# Altium schematic sheet Private_CPU_IO.SchDoc
size D
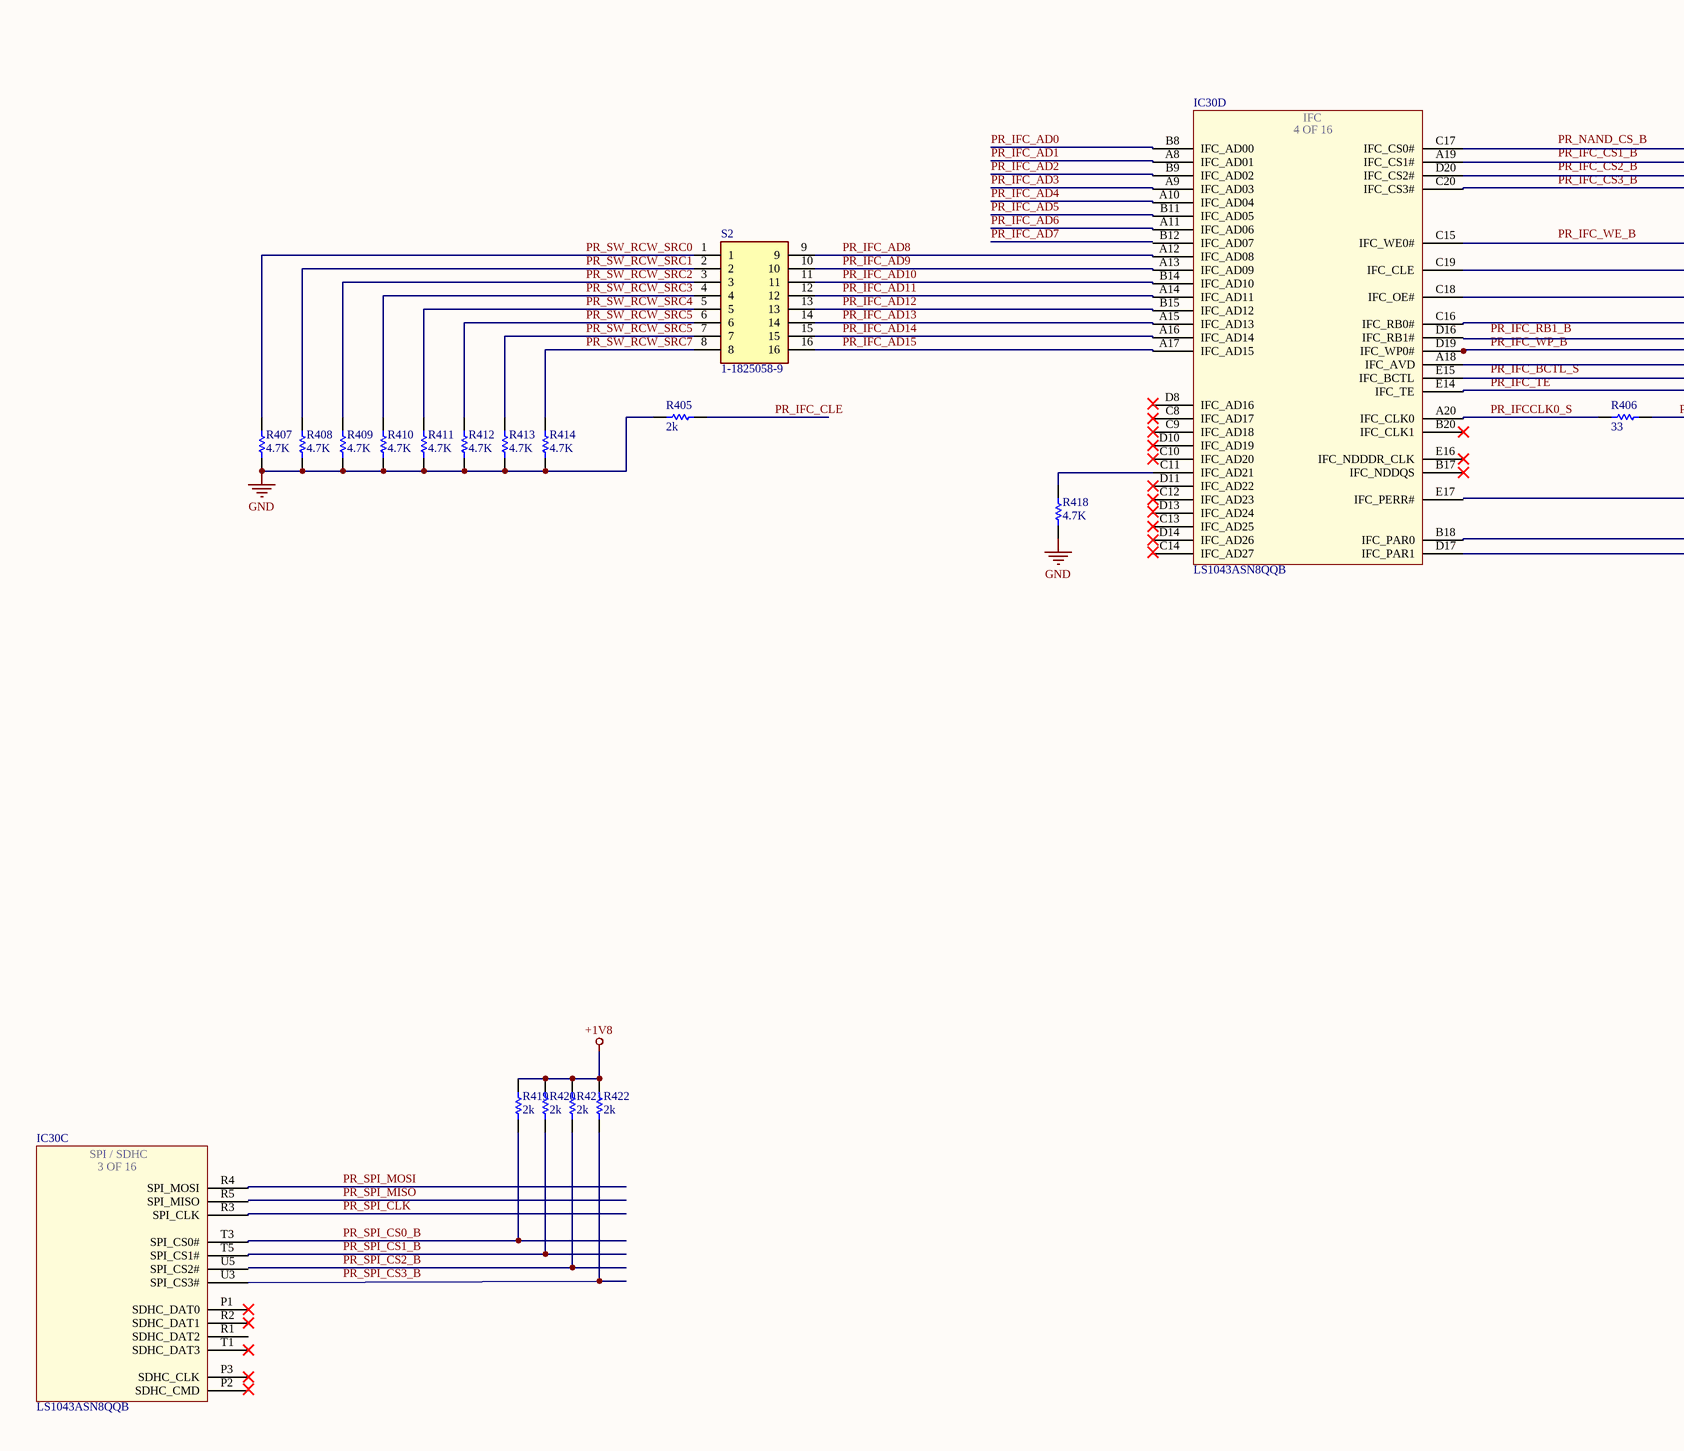
[diagram p0: Private_CPU_IO.SchDoc, left]
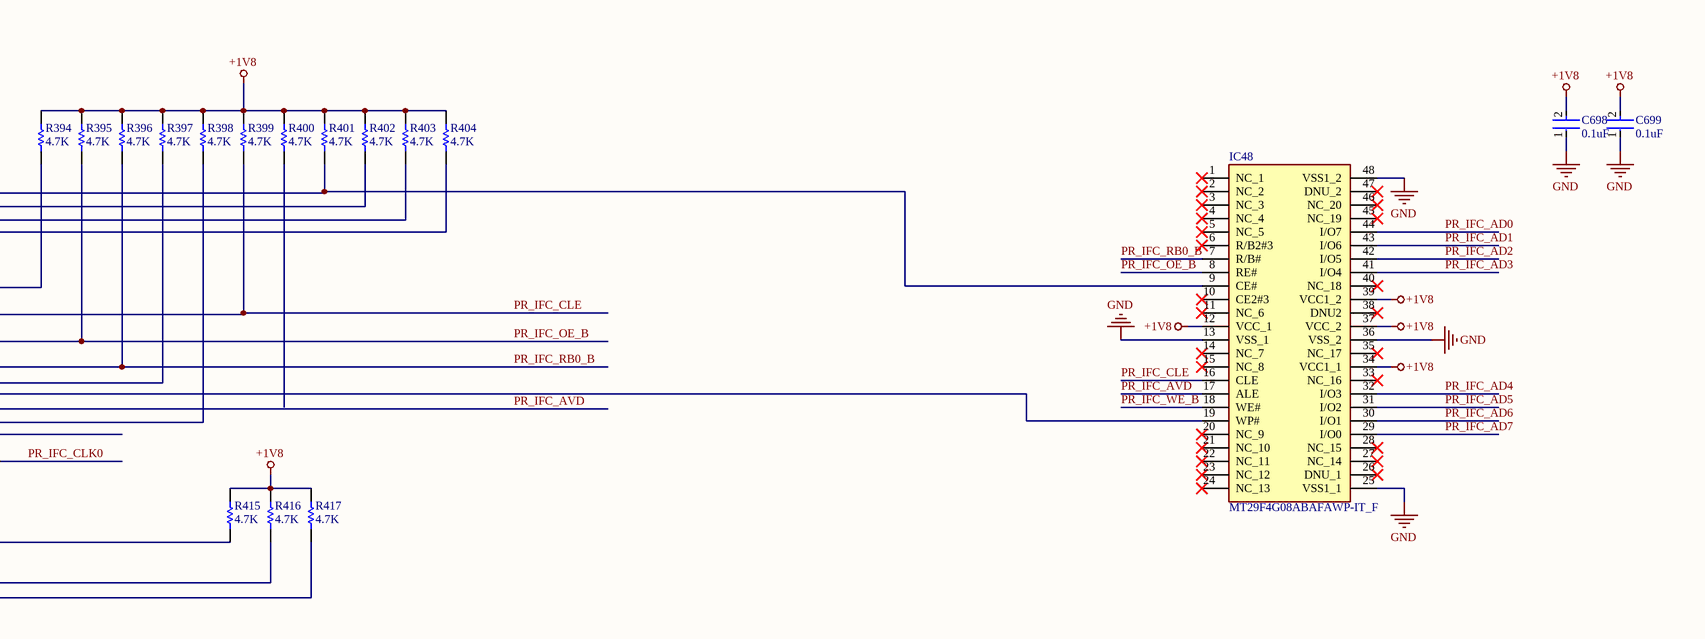
[diagram p1: Private_CPU_IO.SchDoc, right]

## Parts
C698  0.1uF  [FP-GRM15-MFG]
C699  0.1uF  [FP-GRM15-MFG]
IC30  LS1043ASN8QQB  [BGA780C80P28X28_2300X2300X261]  (parts C,D of 16)
IC48  MT29F4G08ABAFAWP-IT_F  [SOP50P2000X120-48N]
R394  4.7K  [RESC1005X40X25LL05T05]
R395  4.7K  [RESC1005X40X25LL05T05]
R396  4.7K  [RESC1005X40X25LL05T05]
R397  4.7K  [RESC1005X40X25LL05T05]
R398  4.7K  [RESC1005X40X25LL05T05]
R399  4.7K  [RESC1005X40X25LL05T05]
R400  4.7K  [RESC1005X40X25LL05T05]
R401  4.7K  [RESC1005X40X25LL05T05]
R402  4.7K  [RESC1005X40X25LL05T05]
R403  4.7K  [RESC1005X40X25LL05T05]
R404  4.7K  [RESC1005X40X25LL05T05]
R405  2k  [RESC1005X40X25NL05T05]
R406  33  [RESC1005X40X25LL05T05]
R407  4.7K  [RESC1005X40X25LL05T05]
R408  4.7K  [RESC1005X40X25LL05T05]
R409  4.7K  [RESC1005X40X25LL05T05]
R410  4.7K  [RESC1005X40X25LL05T05]
R411  4.7K  [RESC1005X40X25LL05T05]
R412  4.7K  [RESC1005X40X25LL05T05]
R413  4.7K  [RESC1005X40X25LL05T05]
R414  4.7K  [RESC1005X40X25LL05T05]
R415  4.7K  [RESC1005X40X25LL05T05]
R416  4.7K  [RESC1005X40X25LL05T05]
R417  4.7K  [RESC1005X40X25LL05T05]
R418  4.7K  [RESC1005X40X25LL05T05]
R419  2k  [RESC1005X40X25NL05T05]
R420  2k  [RESC1005X40X25NL05T05]
R421  2k  [RESC1005X40X25NL05T05]
R422  2k  [RESC1005X40X25NL05T05]
S2  1-1825058-9  [118250589]

## Nets
+1V8: C698.2 C699.2 IC48.12(VCC_1) IC48.34(VCC1_1) IC48.37(VCC_2) IC48.39(VCC1_2) R394.2 R395.2 R396.2 R397.2 R398.2 R399.2 R400.2 R401.2 R402.2 R403.2 R404.2 R415.2 R416.2 R417.2 R419.1 R420.1 R421.1 R422.1
GND: C698.1 C699.1 IC48.13(VSS_1) IC48.25(VSS1_1) IC48.36(VSS_2) IC48.48(VSS1_2) R405.2 R407.1 R408.1 R409.1 R410.1 R411.1 R412.1 R413.1 R414.1 R418.1
PR_IFC_AD0: IC30.B8(IFC_AD00) IC48.44(I/O7)
PR_IFC_AD1: IC30.A8(IFC_AD01) IC48.43(I/O6)
PR_IFC_AD2: IC30.B9(IFC_AD02) IC48.42(I/O5)
PR_IFC_AD3: IC30.A9(IFC_AD03) IC48.41(I/O4)
PR_IFC_AD4: IC30.A10(IFC_AD04) IC48.32(I/O3)
PR_IFC_AD5: IC30.B11(IFC_AD05) IC48.31(I/O2)
PR_IFC_AD6: IC30.A11(IFC_AD06) IC48.30(I/O1)
PR_IFC_AD7: IC48.29(I/O0)
PR_IFC_AD8: IC30.A12(IFC_AD08) S2.9
PR_IFC_AD9: IC30.A13(IFC_AD09) S2.10
PR_IFC_AD10: IC30.B14(IFC_AD10) S2.11
PR_IFC_AD11: IC30.A14(IFC_AD11) S2.12
PR_IFC_AD12: IC30.B15(IFC_AD12) S2.13
PR_IFC_AD13: IC30.A15(IFC_AD13) S2.14
PR_IFC_AD14: IC30.A16(IFC_AD14) S2.15
PR_IFC_AD15: IC30.A17(IFC_AD15) S2.16
PR_IFC_AVD: IC30.A18(IFC_AVD) IC48.17(ALE)
PR_IFC_CLE: IC30.C19(IFC_CLE) IC48.16(CLE) R399.1 R405.1
PR_IFC_CLK0: R406.2
PR_IFC_CS3_B: IC30.C20(IFC_CS3#) R404.1
PR_IFC_OE_B: IC30.C18(IFC_OE#) IC48.8(RE#) R395.1
PR_IFC_RB0_B: IC30.C16(IFC_RB0#) IC48.7(R/B#) R396.1
PR_IFC_TE: IC30.E14(IFC_TE)
PR_IFC_WE_B: IC48.18(WE#)
PR_IFC_WP_B: IC30.D19(IFC_WP0#) IC48.19(WP#)
PR_IFCCLK0_S: IC30.A20(IFC_CLK0) R406.1
PR_SPI_CLK: IC30.R3(SPI_CLK)
PR_SPI_CS0_B: IC30.T3(SPI_CS0#) R419.2
PR_SPI_CS1_B: IC30.T5(SPI_CS1#) R420.2
PR_SPI_CS2_B: R421.2
PR_SPI_MOSI: IC30.R4(SPI_MOSI)
PR_SW_RCW_SRC0: R407.2 S2.1
PR_SW_RCW_SRC1: R408.2 S2.2
PR_SW_RCW_SRC2: R409.2 S2.3
PR_SW_RCW_SRC3: R410.2 S2.4
PR_SW_RCW_SRC4: R411.2 S2.5
PR_SW_RCW_SRC5: R412.2 R413.2 S2.6 S2.7
PR_SW_RCW_SRC7: R414.2 S2.8
NetIC30_A19: IC30.A19(IFC_CS1#) R402.1
NetIC30_B18: IC30.B18(IFC_PAR0) R416.1
NetIC30_C11: IC30.C11(IFC_AD21) R418.2
NetIC30_C15: IC30.C15(IFC_WE0#) R394.1
NetIC30_C17: IC30.C17(IFC_CS0#) IC48.9(CE#) R401.1
NetIC30_D17: IC30.D17(IFC_PAR1) R417.1
NetIC30_D20: IC30.D20(IFC_CS2#) R403.1
NetIC30_E15: IC30.E15(IFC_BCTL) R398.1
NetIC30_U3: IC30.U3(SPI_CS3#) R422.2

Not connected (* = marked no-connect by the designer): IC30 B12(IFC_AD07) B17(IFC_NDDQS)* B20(IFC_CLK1)* C8(IFC_AD17)* C9(IFC_AD18)* C10(IFC_AD20)* C12(IFC_AD23)* C13(IFC_AD25)* C14(IFC_AD27) D8(IFC_AD16) D10(IFC_AD19)* D11(IFC_AD22)* D13(IFC_AD24) D14(IFC_AD26)* D16(IFC_RB1#) E16(IFC_NDDDR_CLK)* E17(IFC_PERR#) P1(SDHC_DAT0)* P2(SDHC_CMD) P3(SDHC_CLK)* R1(SDHC_DAT2) R2(SDHC_DAT1)* R5(SPI_MISO) T1(SDHC_DAT3)* U5(SPI_CS2#); IC48 1(NC_1)* 2(NC_2)* 3(NC_3)* 4(NC_4)* 5(NC_5)* 6(R/B2#3)* 10(CE2#3)* 11(NC_6)* 14(NC_7)* 15(NC_8)* 20(NC_9)* 21(NC_10)* 22(NC_11)* 23(NC_12)* 24(NC_13)* 26(DNU_1)* 27(NC_14)* 28(NC_15)* 33(NC_16)* 35(NC_17)* 38(DNU2)* 40(NC_18)* 45(NC_19)* 46(NC_20)* 47(DNU_2)*; R397 1; R400 1; R415 1

## Notes on the sheet
- Labels drawn without touching a wire or pin: PR_IFC_BCTL_S, PR_IFC_CS1_B, PR_IFC_CS2_B, PR_IFC_RB1_B, PR_IFC_WE_B, PR_NAND_CS_B, PR_SPI_CS3_B
- Title
- Size:
- Date:
- File:
- D
- Number:
- Time:
- Revision:
- Sheet
- of
- (in symbol LS1043ASN8QQB, part C) SPI / SDHC; 3 OF 16
- (in symbol LS1043ASN8QQB, part D) IFC; 4 OF 16

## Library data of the parts
C698 C699 = CMP-2100-03641-2: CAP CER 0.1UF 16V X7R 0402; Manufacturer Part Number: GRM155R71C104KA88D; Manufacturer: Murata; Standoff Height: 0mm; Tolerance: 10%; Voltage Rating: 16Vdc; Material: Ceramic; Capacitance: 0.10μF; Value: 0.10μF; RoHS: TRUE; Temperature Characteristic: X7R; Octopart: https://octopart.com/grm155r71c104ka88d-murata-196880; Digikey Description: CAP CER 0.1UF 16V X7R 0402; Device Class L3: Ceramic Capacitors; Height: 0.55mm; ComponentLink2Description: Datasheet; Temperature Range Low: -55°C; Ipc Land Pattern Name: CAPC10050X219; ComponentLink2URL: https://search.murata.co.jp/Ceramy/image/img/A01X/G101/ENG/GRM155R71H471KA01-01A.pdf; Device Class L1: Passive Components; Lead Free: yes; Category: Cap; Package: GRM15; Temperature: -55°C to +125°C; Device Class L2: Capacitors; Temperature Range High: +125°C; Mouser Description: 0402 0.1 uF 16V ±10 % Tolerance X7R SMT Multilayer Ceramic Capacitor
IC30 = LS1043ASN8QQB: Integrated Circuit; Manufacturer_Name: NXP; Datasheet Link: http://www.nxp.com/secured/assets/documents/en/data-sheet/LS1088A.pdf; Height: 2.61mm; Manufacturer_Part_Number: LS1043ASN8QQB; Mouser Part Number: 771-LS1043ASN8QQB; Mouser Price/Stock: https://www.mouser.co.uk/ProductDetail/NXP-Semiconductors/LS1043ASN8QQB/?qs=AQlKX63v8RsTATOTx7X0Jg%3D%3D
IC48 = MT29F4G08ABAFAWP-IT_F: Integrated Circuit; Manufacturer_Name: Micron; Manufacturer_Part_Number: MT29F4G08ABAFAWP-IT:F; Datasheet Link: https://componentsearchengine.com/Datasheets/2/MT29F4G08ABAFAWP-IT_F.pdf; Height: 1.2mm; Mouser Part Number: 340-371016-TRAY; Mouser Price/Stock: https://www.mouser.co.uk/ProductDetail/Micron/MT29F4G08ABAFAWP-ITF/?qs=0lSvoLzn4L9J4k7jmg5qkQ%3D%3D; Arrow Part Number: MT29F4G08ABAFAWP-IT:F; Arrow Price/Stock: https://www.arrow.com/en/products/mt29f4g08abafawp-itf/micron-technology
R394-R404 R407-R418 = CMP-2002-01154-4: Chip Resistor, 4.7 KOhm, +/- 1%, 0.1 W, -55 to 155 degC, 0402 (1005 Metric), RoHS, Tape and Reel; PartNumber: ERJ-2RKF4701X; Voltage Rating: 50 V; Case\/Package: 0402; Power Rating: 100 mW; Height: 0.35 mm; Mounting Technology: Surface Mount; REACH SVHC: Yes; Resistance: 4.7 KOhm; Max Operating Temperature: 155 degC; ComponentLink1Description: Manufacturer URL; ComponentLink2Description: Datasheet; Pins: 2; PackageReference: 0402; Tolerance: 1%; Case Code (Imperial): 0402; Length: 1 mm; PackageDescription: 2-Pin Surface Mount Device, Body 1 x 0.5 mm; RoHSCompliant: true; Package Quantity: 1; Radiation Hardening: No; DatasheetVersion: 04/2015; Width: 0.5 mm; Case Code (Metric): 1005; Mount: Surface Mount; ComponentLink1URL: http://www.panasonic.com/; Min Operating Temperature: -55 degC; Packaging: Cut Tape; ComponentLink2URL: http://industrial.panasonic.com/cdbs/www-data/pdf/RDA0000/AOA0000C86.pdf
R405 R419-R422 = CMP-2002-00758-3: Chip Resistor, 2 KOhm, +/- 1%, 100 mW, -55 to 155 degC, 0402 (1005 Metric), RoHS, Tape and Reel; Manufacturer: Basic Passives; PartNumber: ERJ-2RKF2001X; Power Rating: 100 mW; Voltage Rating: 50 V; Case\/Package: 0402; Resistance: 2 KOhm; Packaging: Tape and Reel; Tolerance: 1%; PackageReference: 0402; Package Quantity: 10000; ComponentLink1URL: http://www.panasonic.com/; Min Operating Temperature: -55 degC; DatasheetVersion: 04/2015; Case Code (Imperial): 0402; PackageDescription: 2-Pin Surface Mount Device, Body 1 x 0.5 mm; Height: 0.35 mm; Pins: 2; Mount: Surface Mount; Radiation Hardening: No; ComponentLink1Description: Manufacturer URL; ComponentLink2Description: Datasheet; Max Operating Temperature: 155 degC; Case Code (Metric): 1005; Length: 1 mm; RoHSCompliant: true; Mounting Technology: Surface Mount; Width: 0.5 mm; ComponentLink2URL: http://industrial.panasonic.com/cdbs/www-data/pdf/RDA0000/AOA0000C86.pdf; REACH SVHC: Unknown
R406 = CMP-2002-01146-1: Manufacturer: Panasonic; Part Number: ERJ2RKF33R0X
S2 = 1-1825058-9: Switch; Manufacturer_Name: TE Connectivity; Datasheet Link: http://www.te.com/commerce/DocumentDelivery/DDEController?Action=showdoc&DocId=Customer+Drawing%7F1825058%7FS4%7Fpdf%7FEnglish%7FENG_CD_1825058_S4.pdf%7F1-1825058-9; Height: 3mm; Manufacturer_Part_Number: 1-1825058-9; Arrow Part Number: 1-1825058-9; Arrow Price/Stock: https://www.arrow.com/en/products/1-1825058-9/te-connectivity